# Altium schematic sheet Core_Board.SchDoc
size A3
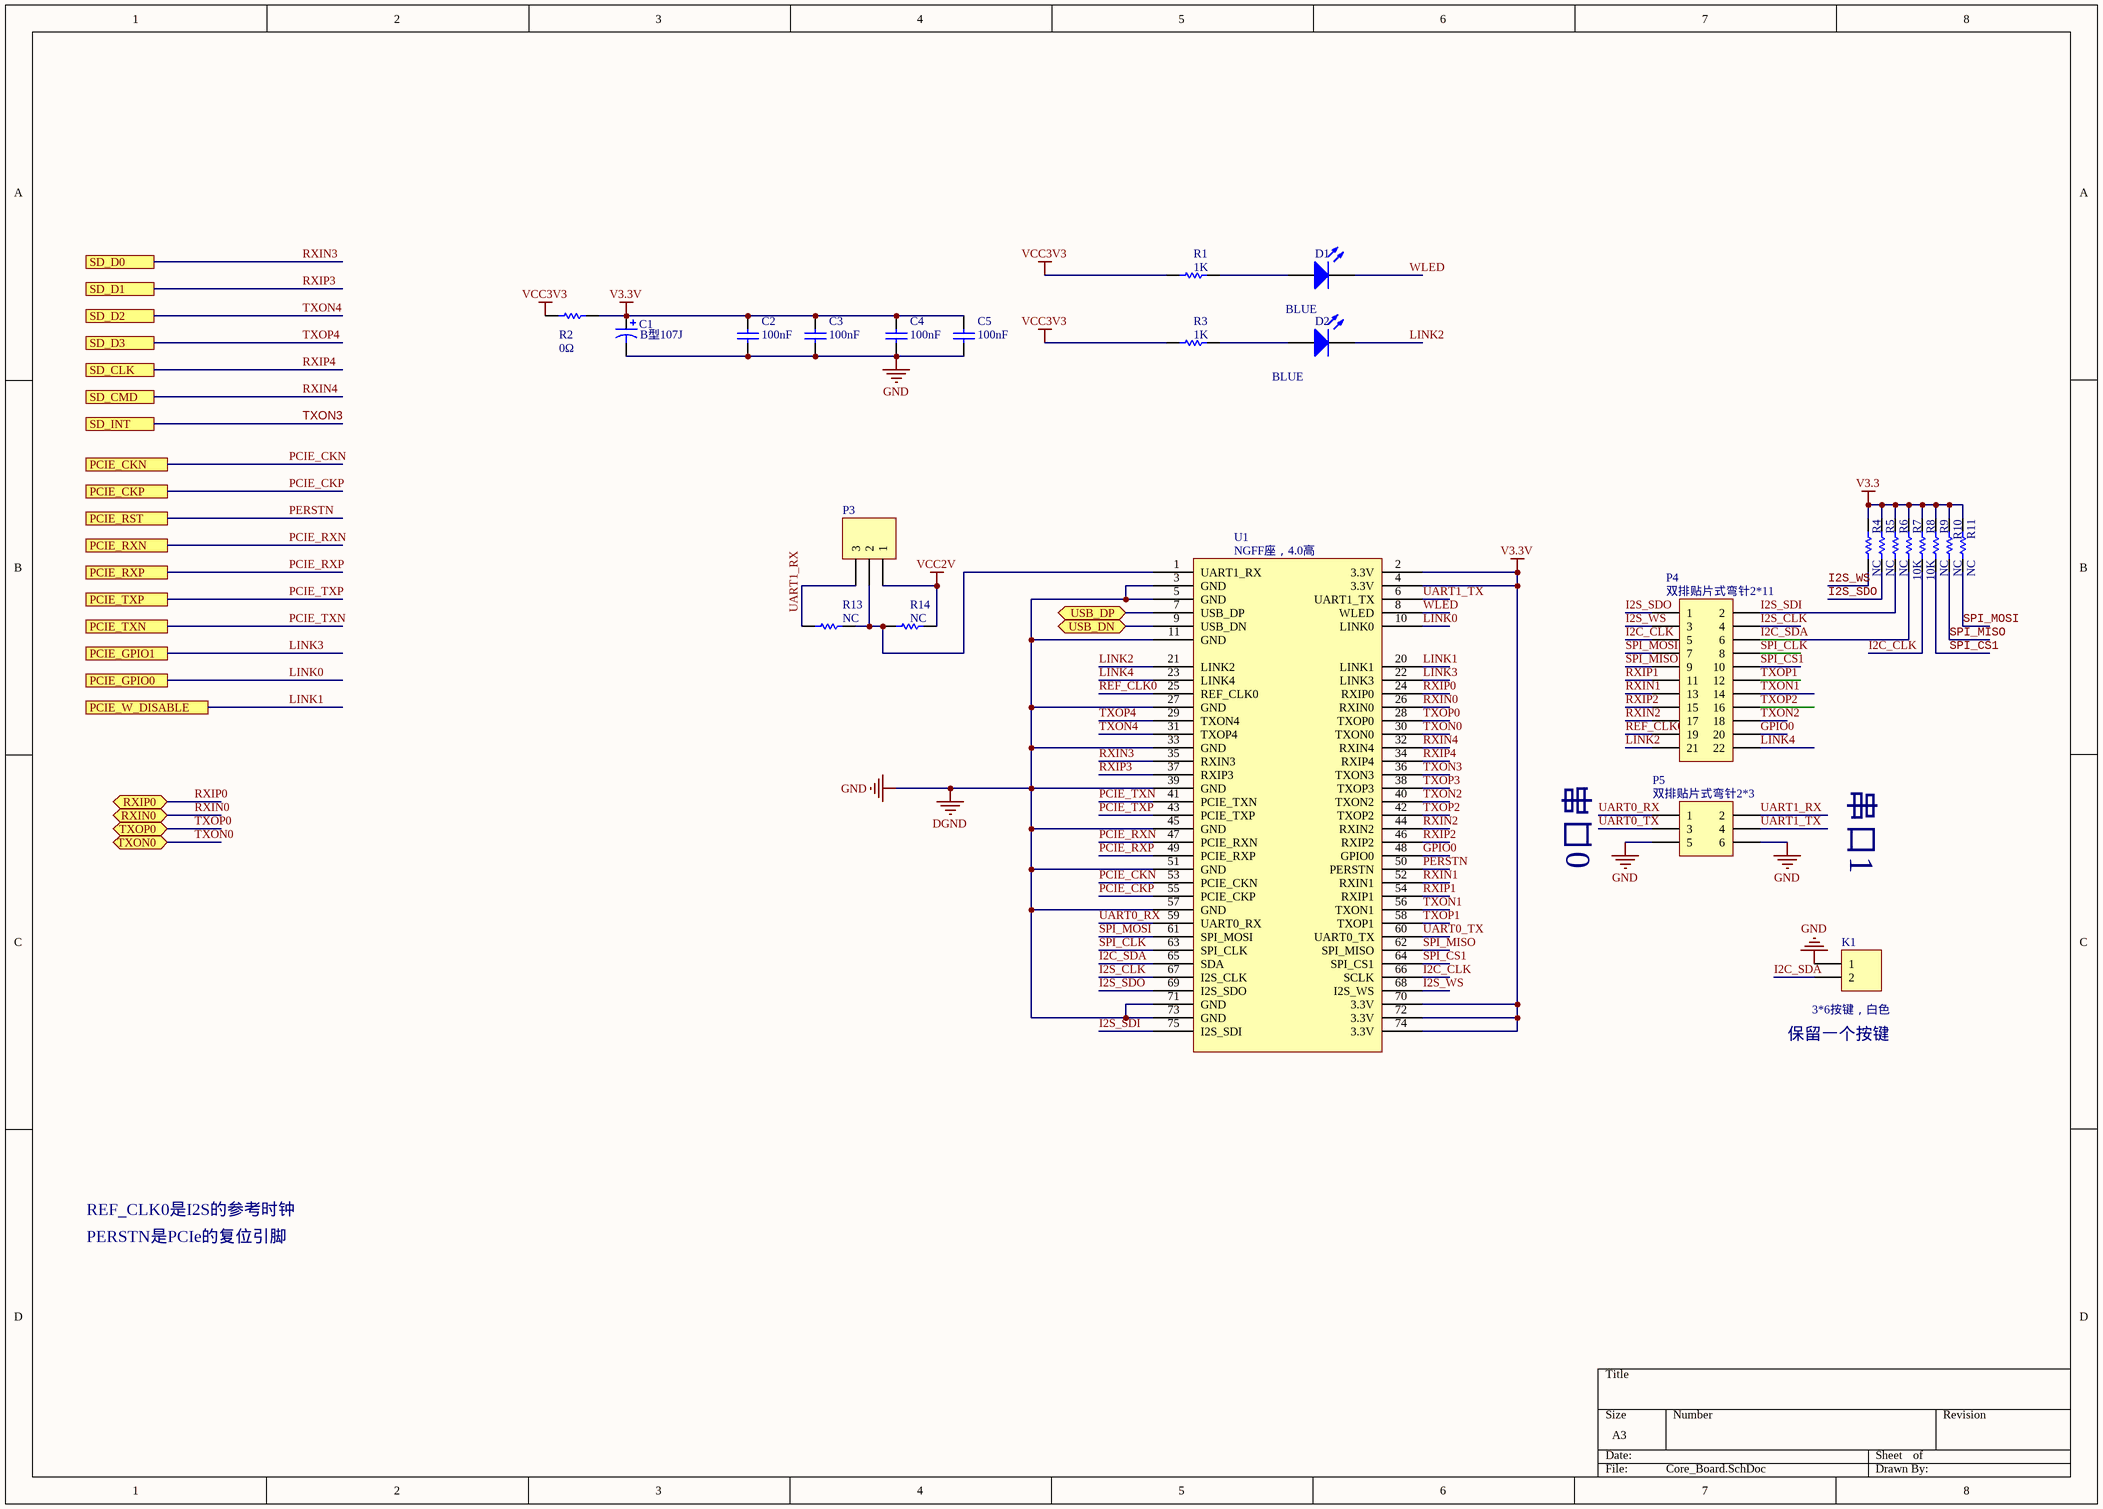
[diagram p0: Core_Board.SchDoc]

## Parts
C1  B型107J  [C1210-A]
C2  100nF  [0402]
C3  100nF  [0402]
C4  100nF  [0402]
C5  100nF  [0402]
D1  BLUE  [LED0603]
D2  BLUE  [LED0603]
K1  3*6按键，白色  [3*6key]
P3  3P单排针  [SIP3-2.54]  (value not drawn)
P4  双排贴片式弯针2*11  [SIP2*11-2.54 PATCH]
P5  双排贴片式弯针2*3  [SIP2*3-2.54 PATCH]
R1  1K  [0402]
R2  0Ω  [R0805N]
R3  1K  [0402]
R4  NC  [0402]
R5  NC  [0402]
R6  NC  [0402]
R7  10K  [0402]
R8  10K  [0402]
R9  NC  [0402]
R10  NC  [0402]
R11  NC  [0402]
R13  NC  [0402]
R14  NC  [0402]
U1  NGFF座，4.0高  [NGFF M.2]

## Ports
PCIE_CKN, PCIE_CKP, PCIE_GPIO0, PCIE_GPIO1, PCIE_RST, PCIE_RXN, PCIE_RXP, PCIE_TXN, PCIE_TXP, PCIE_W_DISABLE, RXIN0, RXIP0, SD_CLK, SD_CMD, SD_D0, SD_D1, SD_D2, SD_D3, SD_INT, TXON0, TXOP0, USB_DN, USB_DP

## Nets
DGND: C1.2 C2.1 C3.1 C4.1 C5.1 K1.1 P5.5 P5.6 U1.3(GND) U1.5(GND) U1.11(GND) U1.27(GND) U1.33(GND) U1.39(GND) U1.45(GND) U1.51(GND) U1.57(GND) U1.71(GND) U1.73(GND)  [also labelled GND]
V3.3: R4.2 R5.2 R6.2 R7.2 R8.2 R9.2 R10.2 R11.2
V3.3V: C1.1 C2.2 C3.2 C4.2 C5.2 R2.2 U1.2(3.3V) U1.4(3.3V) U1.70(3.3V) U1.72(3.3V) U1.74(3.3V)
VCC2V: P3.1 R14.2
VCC3V3: R1.1 R2.1 R3.1
GPIO0: P4.20 U1.48(GPIO0)
I2C_CLK: P4.5 R8.1 U1.66(SCLK)
I2C_SDA: K1.2 P4.6 R7.1 U1.65(SDA)
I2S_CLK: P4.4 U1.67(I2S_CLK)
I2S_SDI: P4.2 R6.1 U1.75(I2S_SDI)
I2S_SDO: P4.1 R5.1 U1.69(I2S_SDO)
I2S_WS: P4.3 R4.1 U1.68(I2S_WS)
LINK0: U1.10(LINK0) ; port PCIE_GPIO0
LINK1: U1.20(LINK1) ; port PCIE_W_DISABLE
LINK2: D2.2 P4.21 U1.21(LINK2)
LINK3: U1.22(LINK3) ; port PCIE_GPIO1
LINK4: P4.22 U1.23(LINK4)
PCIE_CKN: U1.53(PCIE_CKN) ; port PCIE_CKN
PCIE_CKP: U1.55(PCIE_CKP) ; port PCIE_CKP
PCIE_RXN: U1.47(PCIE_RXN) ; port PCIE_RXN
PCIE_RXP: U1.49(PCIE_RXP) ; port PCIE_RXP
PCIE_TXN: U1.41(PCIE_TXN) ; port PCIE_TXN
PCIE_TXP: U1.43(PCIE_TXP) ; port PCIE_TXP
PERSTN: U1.50(PERSTN) ; port PCIE_RST
REF_CLK0: P4.19 U1.25(REF_CLK0)
RXIN0: U1.26(RXIN0) ; port RXIN0
RXIN1: P4.13 U1.52(RXIN1)
RXIN2: P4.17 U1.44(RXIN2)
RXIN3: U1.35(RXIN3) ; port SD_D0
RXIN4: U1.32(RXIN4) ; port SD_CMD
RXIP0: U1.24(RXIP0) ; port RXIP0
RXIP1: P4.11 U1.54(RXIP1)
RXIP2: P4.15 U1.46(RXIP2)
RXIP3: U1.37(RXIP3) ; port SD_D1
RXIP4: U1.34(RXIP4) ; port SD_CLK
SPI_CLK: P4.8 U1.63(SPI_CLK)
SPI_CS1: P4.10 R9.1 U1.64(SPI_CS1)
SPI_MISO: P4.9 R10.1 U1.62(SPI_MISO)
SPI_MOSI: P4.7 R11.1 U1.61(SPI_MOSI)
TXON0: U1.30(TXON0) ; port TXON0
TXON1: P4.14 U1.56(TXON1)
TXON2: P4.18 U1.40(TXON2)
TXON3: U1.36(TXON3) ; port SD_INT
TXON4: U1.31(TXOP4) ; port SD_D2
TXOP0: U1.28(TXOP0) ; port TXOP0
TXOP1: P4.12 U1.58(TXOP1)
TXOP2: P4.16 U1.42(TXOP2)
TXOP3: U1.38(TXOP3)
TXOP4: U1.29(TXON4) ; port SD_D3
UART0_RX: P5.1 U1.59(UART0_RX)
UART0_TX: P5.3 U1.60(UART0_TX)
UART1_RX: P3.3 P5.2 R13.1
UART1_TX: P5.4 U1.6(UART1_TX)
USB_DN: U1.9(USB_DN) ; port USB_DN
USB_DP: U1.7(USB_DP) ; port USB_DP
WLED: D1.2 U1.8(WLED)
NetD1_1: D1.1 R1.2
NetD2_1: D2.1 R3.2
NetP3_2: P3.2 R13.2 R14.1 U1.1(UART1_RX)

## Notes on the sheet
- 串口1
- 0口串
- (near K1) 保留一个按键
- REF_CLK0是I2S的参考时钟
- PERSTN是PCIe的复位引脚

## Library data of the parts
C1 = Cap Pol1: Polarized Capacitor (Radial); Published: 8-Jun-2000; LatestRevisionDate: 17-Jul-2002; LatestRevisionNote: Re-released for DXP Platform.; PackageReference: RB7.6-15; Publisher: Altium Limited; Value: B型107J
C2-C5 = Cap: Capacitor; Published: 8-Jun-2000; LatestRevisionDate: 17-Jul-2002; LatestRevisionNote: Re-released for DXP Platform.; PackageReference: RAD-0.3; Publisher: Altium Limited; Value: 100nF
D1 D2 = LED: Value: BLUE
K1 = Header 2: Header, 2-Pin; LatestRevisionDate: 17-Jul-2002; LatestRevisionNote: Re-released for DXP Platform.; Publisher: Altium Limited; Value: 3*6按键，白色
P3 = Header 3: Header, 3-Pin; LatestRevisionDate: 17-Jul-2002; LatestRevisionNote: Re-released for DXP Platform.; Publisher: Altium Limited; Value: 3P单排针
P4 = Header 11X2: Header, 11-Pin, Dual row; LatestRevisionDate: 17-Jul-2002; LatestRevisionNote: Re-released for DXP Platform.; Publisher: Altium Limited; Value: 双排贴片式弯针2*11
P5 = Header 3X2: Header, 3-Pin, Dual row; LatestRevisionDate: 17-Jul-2002; LatestRevisionNote: Re-released for DXP Platform.; Publisher: Altium Limited; Value: 双排贴片式弯针2*3
R1-R11 R13 R14 = Res Semi: Semiconductor Resistor
  R1 R3: Value: 1K
  R2: Published: 8-Jun-2000; LatestRevisionDate: 17-Jul-2002; LatestRevisionNote: Re-released for DXP Platform.; PackageReference: AXIAL-0.5; Publisher: Altium Limited; Value: 0Ω
  R4-R6 R9-R11: Value: NC
  R7 R8: Value: 10K
  R13 R14: Published: 8-Jun-2000; LatestRevisionDate: 17-Jul-2002; LatestRevisionNote: Re-released for DXP Platform.; PackageReference: AXIAL-0.5; Publisher: Altium Limited; Value: NC
U1 = core: Value: NGFF座，4.0高